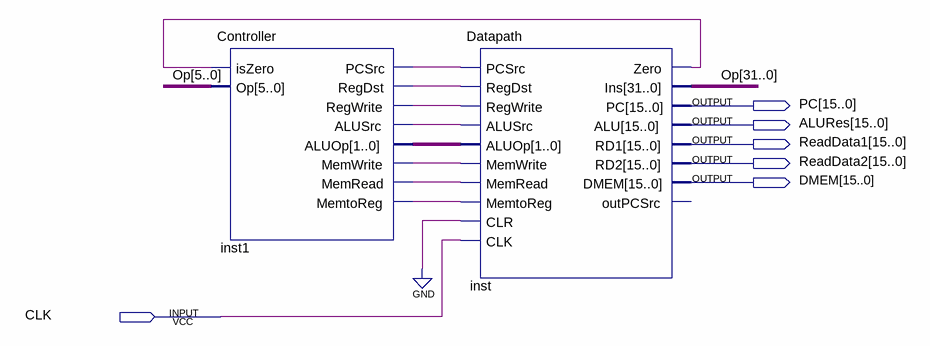
[diagram p0: schematic sheet]
// Quartus schematic MIPS.bdf as structural Verilog: 2 symbols, 6 pins
module MIPS (
  input  CLK,
  output [15:0] PC,
  output [15:0] ALURes,
  output [15:0] ReadData1,
  output [15:0] ReadData2,
  output [15:0] DMEM
);

  wire inst1_alusrc, inst1_memread, inst1_memtoreg, inst1_memwrite, inst1_pcsrc, inst1_regdst,
       inst1_regwrite, inst_zero;
  wire [1:0] inst1_aluop;
  wire [31:0] Op;

  Controller inst1 (
    .Op(Op[5:0]), .isZero(inst_zero), .RegDst(inst1_regdst), .ALUSrc(inst1_alusrc),
    .MemtoReg(inst1_memtoreg), .MemRead(inst1_memread), .MemWrite(inst1_memwrite), .RegWrite(inst1_regwrite),
    .PCSrc(inst1_pcsrc), .ALUOp(inst1_aluop));
  Datapath inst (
    .PCSrc(inst1_pcsrc), .RegDst(inst1_regdst), .RegWrite(inst1_regwrite), .ALUSrc(inst1_alusrc),
    .ALUOp(inst1_aluop), .MemWrite(inst1_memwrite), .MemRead(inst1_memread), .MemtoReg(inst1_memtoreg),
    .CLR(1'b0), .CLK(CLK), .Zero(inst_zero), .Ins(Op), .PC(PC), .ALU(ALURes), .RD1(ReadData1),
    .RD2(ReadData2), .DMEM(DMEM));  // open: outPCSrc
endmodule
